# Altium project Led_orb.PrjPcb
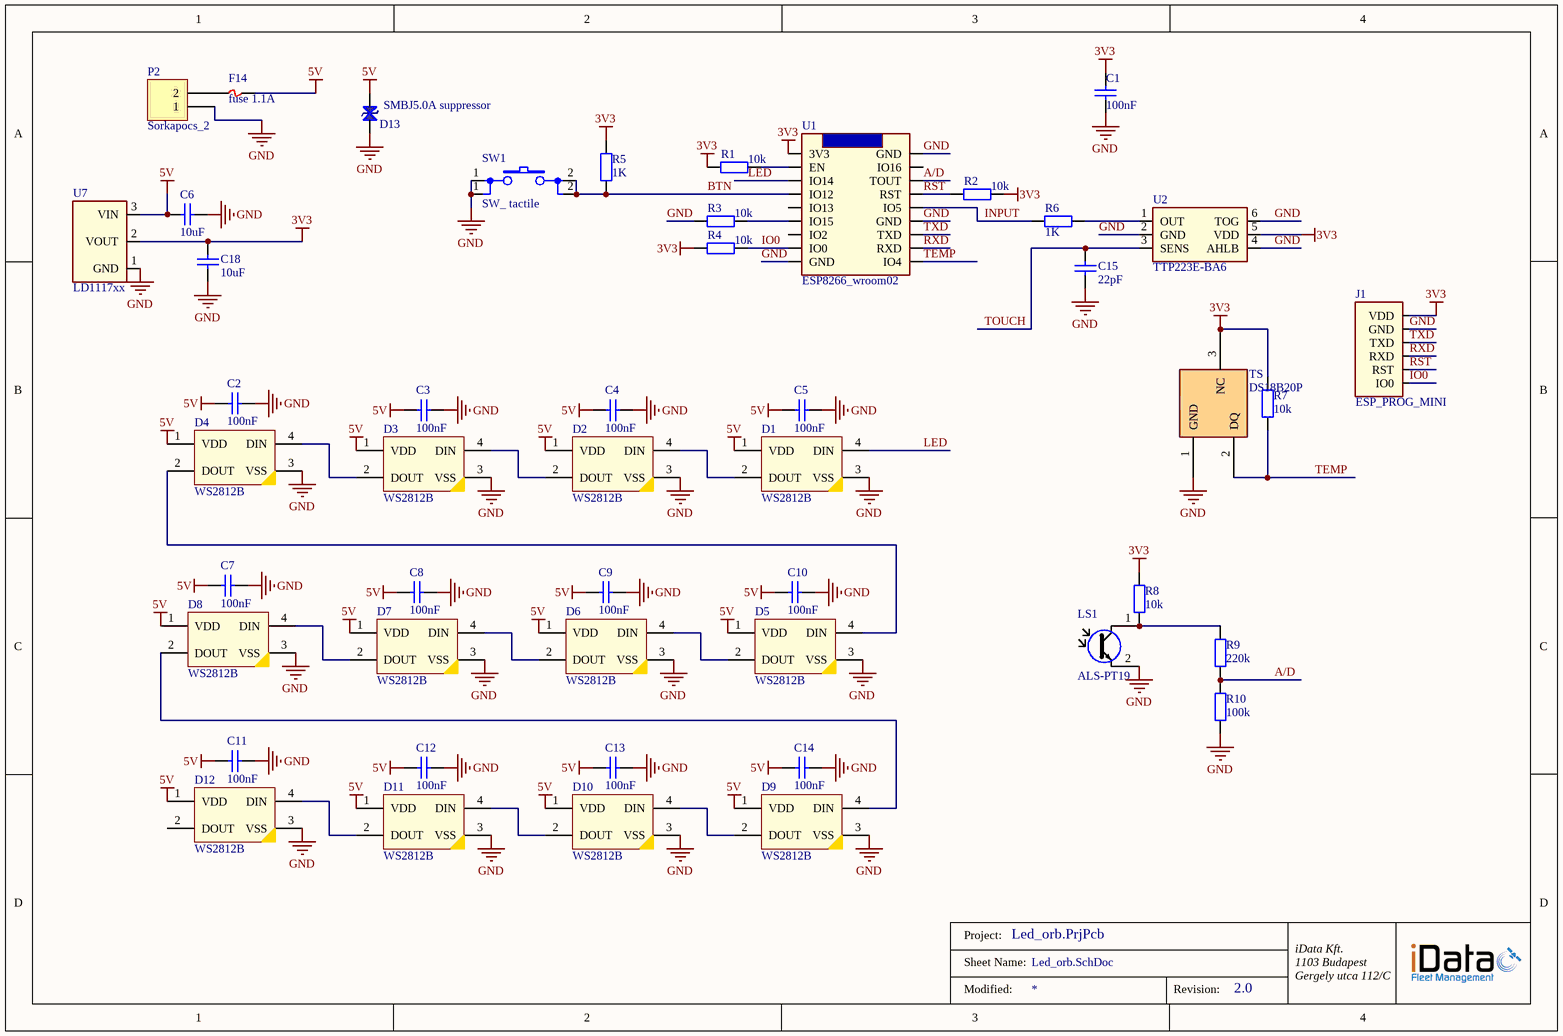
[diagram p0: Led_orb.SchDoc]
1 sheet, 48 parts. Net scope: global (net labels, ports and power ports of the same name join across sheets).
Board file: Led_orb.PcbDoc

## Sheet Led_orb.SchDoc
size A4; CompanyName: iData Kft.; Organization: iData Kft.; Address1: 1103 Budapest; Address2: Gergely utca 112/C; Revision: 2.0; ProductionState: Prototype

### Parts
C1  100nF  [FP_0603_CAP_080]
C2  100nF  [FP_0603_CAP_080]
C3  100nF  [FP_0603_CAP_080]
C4  100nF  [FP_0603_CAP_080]
C5  100nF  [FP_0603_CAP_080]
C6  10uF  [FP_1206_CAP_085]
C7  100nF  [FP_0603_CAP_080]
C8  100nF  [FP_0603_CAP_080]
C9  100nF  [FP_0603_CAP_080]
C10  100nF  [FP_0603_CAP_080]
C11  100nF  [FP_0603_CAP_080]
C12  100nF  [FP_0603_CAP_080]
C13  100nF  [FP_0603_CAP_080]
C14  100nF  [FP_0603_CAP_080]
C15  22pF  [FP_0603_CAP_080]
C18  10uF  [FP_1206_CAP_085]
D1  WS2812B  [LED_5050_4pin]
D2  WS2812B  [LED_5050_4pin]
D3  WS2812B  [LED_5050_4pin]
D4  WS2812B  [LED_5050_4pin]
D5  WS2812B  [LED_5050_4pin]
D6  WS2812B  [LED_5050_4pin]
D7  WS2812B  [LED_5050_4pin]
D8  WS2812B  [LED_5050_4pin]
D9  WS2812B  [LED_5050_4pin]
D10  WS2812B  [LED_5050_4pin]
D11  WS2812B  [LED_5050_4pin]
D12  WS2812B  [LED_5050_4pin]
D13  SMBJ5.0A suppressor  [FP_SMB DO214AA]
F14  fuse 1.1A  [Fuse-Littlefuse-1812]
J1  ESP_PROG_MINI  [ESP_PROG_MINI]  (no BOM)
LS1  ALS-PT19  [ALS-PT19]
P2  Sorkapocs_2  [Sorkapocs_5mm_2P]
R1  10k  [FP_0603_RES]
R2  10k  [FP_0603_RES]
R3  10k  [FP_0603_RES]
R4  10k  [FP_0603_RES]
R5  1K  [FP_0603_RES]
R6  1K  [FP_0603_RES]
R7  10k  [FP_0603_RES]
R8  10k  [FP_0603_RES]
R9  220k  [FP_0603_RES]
R10  100k  [FP_0603_RES]
SW1  SW_ tactile  [FP_TACTBTN]
TS  DS18B20P  [SENSOR_TO92]
U1  ESP8266_wroom02  [ESP8266_wroom02]
U2  TTP223E-BA6  [SWITCH_SOT23-6]
U7  LD1117xx  [SUPPLY_SOT223]

### Nets
3V3: C1.2 C18.2 J1.1(VDD) R1.2 R2.2 R4.2 R5.1 R7.2 R8.2 TS.3(NC) U1.1(3V3) U2.5(VDD) U7.2(VOUT)
5V: C2.2 C3.2 C4.2 C5.2 C6.2 C7.2 C8.2 C9.2 C10.2 C11.2 C12.2 C13.2 C14.2 D1.1(VDD) D2.1(VDD) D3.1(VDD) D4.1(VDD) D5.1(VDD) D6.1(VDD) D7.1(VDD) D8.1(VDD) D9.1(VDD) D10.1(VDD) D11.1(VDD) D12.1(VDD) D13.K F14.1 U7.3(VIN)
GND: C1.1 C2.1 C3.1 C4.1 C5.1 C6.1 C7.1 C8.1 C9.1 C10.1 C11.1 C12.1 C13.1 C14.1 C15.1 C18.1 D1.3(VSS) D2.3(VSS) D3.3(VSS) D4.3(VSS) D5.3(VSS) D6.3(VSS) D7.3(VSS) D8.3(VSS) D9.3(VSS) D10.3(VSS) D11.3(VSS) D12.3(VSS) D13.A J1.2(GND) LS1.2 P2.1 R3.2 R10.1 SW1.1 TS.1(GND) U1.9(GND) U1.13(GND) U1.18(GND) U2.2(GND) U2.4(AHLB) U2.6(TOG) U7.1(GND)
A/D: R9.1 R10.2 U1.16(TOUT)
BTN: R5.2 SW1.2 U1.4(IO12)
INPUT: R6.1 U1.14(IO5)
IO0: J1.6(IO0) R4.1 U1.8(IO0)
LED: D1.4(DIN) U1.3(IO14)
RST: J1.5(RST) R2.1 U1.15(RST)
RXD: J1.4(RXD) U1.11(RXD)
TEMP: R7.1 TS.2(DQ) U1.10(IO4)
TOUCH: C15.2 U2.3(SENS)
TXD: J1.3(TXD) U1.12(TXD)
NetD1_2: D1.2(DOUT) D2.4(DIN)
NetD2_2: D2.2(DOUT) D3.4(DIN)
NetD3_2: D3.2(DOUT) D4.4(DIN)
NetD4_2: D4.2(DOUT) D5.4(DIN)
NetD5_2: D5.2(DOUT) D6.4(DIN)
NetD6_2: D6.2(DOUT) D7.4(DIN)
NetD7_2: D7.2(DOUT) D8.4(DIN)
NetD8_2: D8.2(DOUT) D9.4(DIN)
NetD9_2: D9.2(DOUT) D10.4(DIN)
NetD10_2: D10.2(DOUT) D11.4(DIN)
NetD11_2: D11.2(DOUT) D12.4(DIN)
NetF14_2: F14.2 P2.2
NetLS1_1: LS1.1 R8.1 R9.2
NetR1_1: R1.1 U1.2(EN)
NetR3_1: R3.1 U1.6(IO15)
NetR6_2: R6.2 U2.1(OUT)

Not connected (* = marked no-connect by the designer): D12 2(DOUT); U1 5(IO13) 7(IO2) 17(IO16)

### Notes on the sheet
- Project:
- Sheet Name:
- iData Kft.
- 1103 Budapest
- Gergely utca 112/C
- Modified:
- Revision:

### Library data of the parts
C1-C5 C7-C14 = CAP: Capacitor; Part number: 100nF_0603_50V_X7R_10percent; Value: 100nF; Sample: 82-12-71
C6 C18 = Cap: Capacitor ceramic X7R; Value: 100nF; Order info: 82-08-03
C15 = Cap: Capacitor; Part number: 22pF_0603_50V_NP0_5percent; Leírás: Capacitor ceramic NP0; Value: 22pF; Sample: 82-02-18
D13 = Suppressor diode: Leírás: Diode SMBJ5.0A suppressor; Part number: SMBJ5.0A; Sample: 96-00-74
F14 = FUSE: Part number: 1812L110/33; Leírás: Resettable Fuses - PPTC PTC 33V 1.10A POLY SURF MOUNT 1812; Sample: https://hu.mouser.com/ProductDetail/Littelfuse/1812L110-33MR?qs=PWhpLWeW8wdL8%252bas2HFkoA%3D%3D
LS1 = ALS-PT19: ALS-PT19 Ambient Light Sensor; Part number: ALS-PT19-315C/L177/TR8; Sample: https://lcsc.com/product-detail/Photoresistors_ALS-PT19-315C-L177-TR8_C146233.html
P2 = Header 1X2: Header, 2-Pin; Order info: 43-06-54
R1-R4 R7 R8 = Res3: Resistor; Part number: 10k_0603_1percent; Value: 10k; Sample: 80-15-13
R5 R6 = RES: Resistor; Part number: 1k_0603_1percent; Value: 1K; Leírás: Resistor; Sample: 80-11-59
R9 = Res3: Resistor; Part number: 220k_0603_1percent; Sample: TODO; Value: 220k
R10 = Res3: Resistor; Part number: 100k_0603_1percent; Value: 100k
TS = DS18B20P: Part number: DS18B20+PAR; Sample: http://hu.mouser.com/ProductDetail/Maxim-Integrated/DS18B20+PAR/?qs=sGAEpiMZZMucenltShoSnqz2Nq7rAtSUU07bIAAmMis%3d
U1 = ESP8266_wroom02: ESP8266 WROOM 02 wifi module; Part number: ESP_WROOM02; Sample: *
U2 = TTP223E-BA6: SOT-23-6 Touch Sensor Controller ICs RoHS; Part number: TTP223E-BA6; Sample: https://lcsc.com/product-detail/Touch-Screen-Controller-ICs_TTP223E-BA6_C129457.html
U7 = LD1117xx: LD1117xx 3,3V lin reg; Order info: 89-06-98